# Altium project UKU20710_POW.PrjPCB
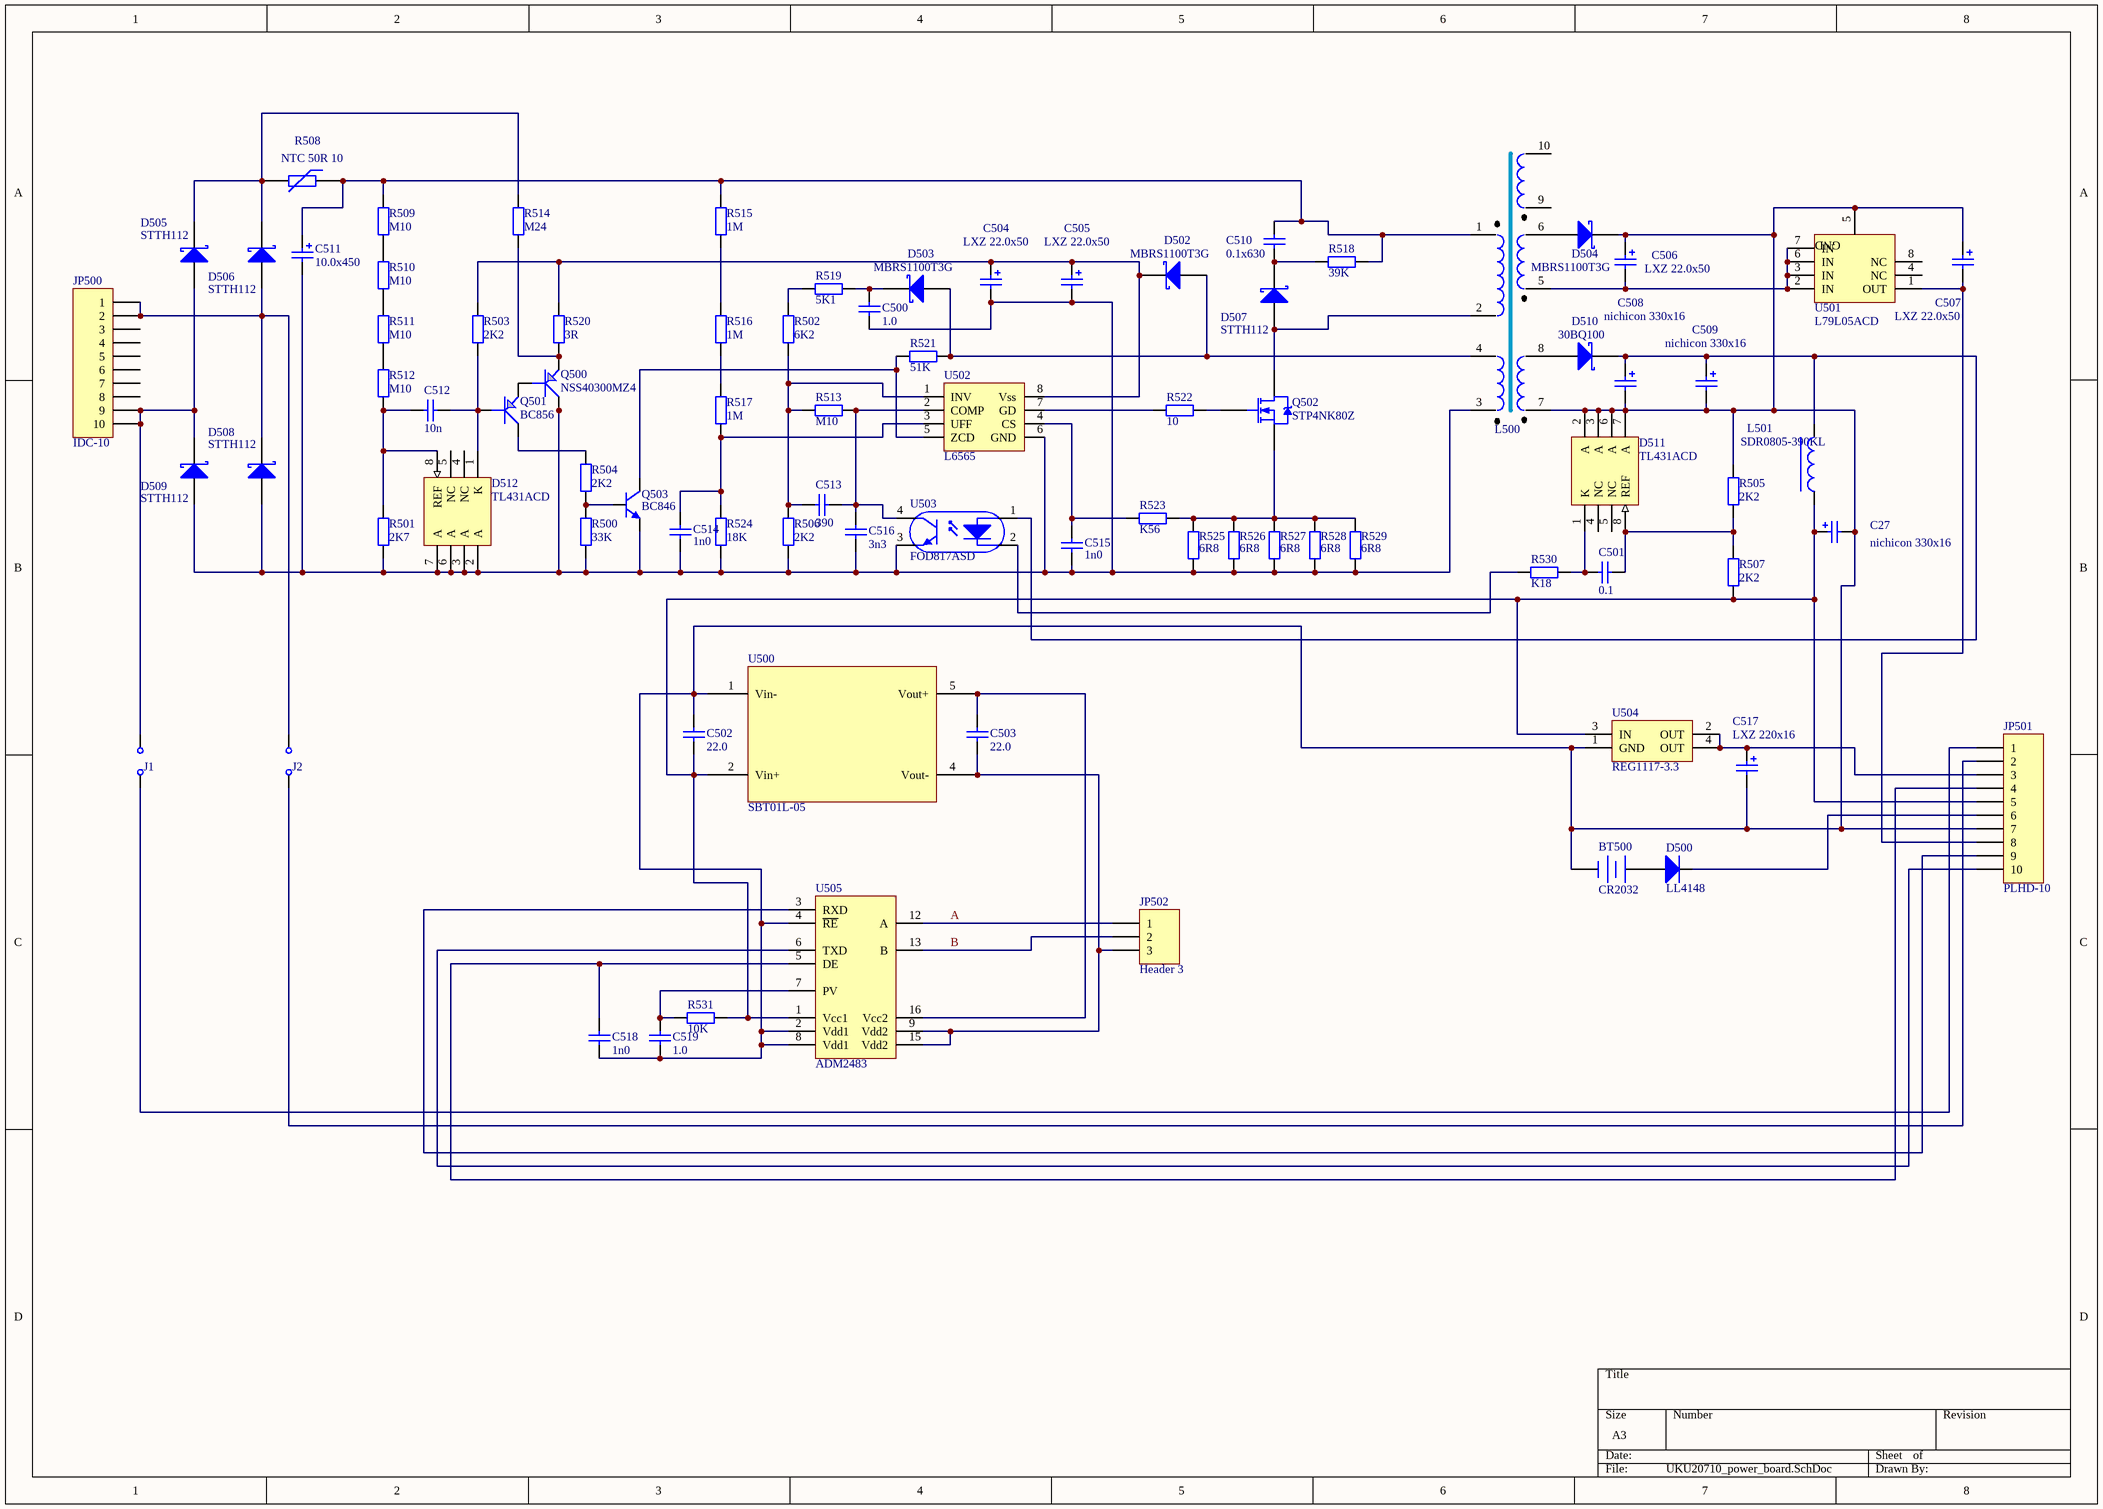
[diagram p0: UKU20710_power_board.SchDoc]
1 sheet, 83 parts. Net scope: global (net labels, ports and power ports of the same name join across sheets).
Board file: uku20710_pow.PcbDoc

## Sheet UKU20710_power_board.SchDoc
size A3

### Parts
BT500  CR2032  [BAT_SUPP]
C27  nichicon 330x16  [el3]
C500  1.0  [_1206]
C501  0.1  [_1206]
C502  22.0  [_1206]
C503  22.0  [_1206]
C504  LXZ 22.0x50  [el3]
C505  LXZ 22.0x50  [el3]
C506  LXZ 22.0x50  [el3]
C507  LXZ 22.0x50  [el3]
C508  nichicon 330x16  [el3]
C509  nichicon 330x16  [el3]
C510  0.1x630  [c15]
C511  10.0x450  [el_15_25_h]
C512  10n  [_1206]
C513  390  [_1206]
C514  1n0  [_1206]
C515  1n0  [_1206]
C516  3n3  [_1206]
C517  LXZ 220x16  [el3]
C518  1n0  [_1206]
C519  1.0  [_1206]
D500  LL4148  [_1206d]
D502  MBRS1100T3G  [D_6_3]
D503  MBRS1100T3G  [D_6_3]
D504  MBRS1100T3G  [D_6_3]
D505  STTH112  [D_6_3]
D506  STTH112  [D_6_3]
D507  STTH112  [D_6_3]
D508  STTH112  [D_6_3]
D509  STTH112  [D_6_3]
D510  30BQ100  [30BQ100]
D511  TL431ACD  [SO-G8]
D512  TL431ACD  [SO-G8]
J1  (no value)  [BT5-2]
J2  (no value)  [BT5-2]
JP500  IDC-10  [HDR2X5]
JP501  PLHD-10  [HDR2X5]
JP502  Header 3  [2EDG-5.08-3P]
L500  L220-K10  [trans_ring1]  (value not drawn)
L501  SDR0805-390KL  [L10x10]
Q500  NSS40300MZ4  [DSO-G3]
Q501  BC856  [SO-G3]
Q502  STP4NK80Z  [TO220_h]
Q503  BC846  [SO-G3]
R500  33K  [_1206]
R501  2K7  [_1206]
R502  6K2  [_1206]
R503  2K2  [_1206]
R504  2K2  [_1206]
R505  2K2  [_1206]
R506  2K2  [_1206]
R507  2K2  [_1206]
R508  NTC 50R 10  [JVR07N]
R509  M10  [_1206]
R510  M10  [_1206]
R511  M10  [_1206]
R512  M10  [_1206]
R513  M10  [_1206]
R514  M24  [AXIAL-0.7]
R515  1M  [_1206]
R516  1M  [_1206]
R517  1M  [_1206]
R518  39K  [AXIAL-0.7]
R519  5K1  [_1206]
R520  3R  [_1206]
R521  51K  [_1206]
R522  10  [_1206]
R523  K56  [_1206]
R524  18K  [_1206]
R525  6R8  [_1206]
R526  6R8  [_1206]
R527  6R8  [_1206]
R528  6R8  [_1206]
R529  6R8  [_1206]
R530  K18  [_1206]
R531  10K  [_1206]
U500  SBT01L-05  [SBT01DET01]
U501  L79L05ACD  [SO-G8]
U502  L6565  [so-g8]
U503  FOD817ASD  [FOD817ASD]
U504  REG1117-3.3  [DSO-G3]
U505  ADM2483  [SO-G16/D10.4]

### Nets
A: JP502.1 U505.12(A)
B: JP502.2 U505.13(B)
NetBT500_1: BT500.1(+) D500.1(A)
NetBT500_2: BT500.2(-) C27.2 C502.1 C506.1 C507.1 C508.2 C509.2 C517.2 C518.1 C519.1 D504.2(K) D511.2(A) D511.3(A) D511.6(A) D511.7(A) JP501.7 L500.7 R505.2 U500.1(Vin-) U501.5(GND) U504.1(GND) U505.2(Vdd1) U505.4(~{RE}) U505.8(Vdd1)
NetC27_1: C27.1 C502.2 JP501.5 L501.1 R507.1 R531.1 U500.2(Vin+) U504.3(IN) U505.1(Vcc1)
NetC500_1: C500.1 C504.2 C505.2 C511.2 C514.2 C515.2 C516.1 D508.1(A) D509.1(A) D512.2(A) D512.3(A) D512.6(A) D512.7(A) L500.3 Q500.2(C) Q500.4(C) Q503.2(E) R500.1 R501.1 R506.1 R524.1 R525.2 R526.2 R527.2 R528.2 R529.2 U502.6(GND) U503.3
NetC500_2: C500.2 D503.2(K) R519.1
NetC501_1: C501.1 D511.8(REF) R505.1 R507.2
NetC501_2: C501.2 D511.1(K) R530.1
NetC503_1: C503.1 U500.5(Vout+) U505.16(Vcc2)
NetC503_2: C503.2 JP502.3 U500.4(Vout-) U505.9(Vdd2) U505.15(Vdd2)
NetC504_1: C504.1 C505.1 D502.2(K) R503.2 R520.2 U502.8(Vss)
NetC506_2: C506.2 L500.5 U501.2(IN) U501.3(IN) U501.6(IN) U501.7(IN)
NetC507_2: C507.2 JP501.8 U501.1(OUT)
NetC508_1: C508.1 C509.1 D510.2(K) L501.2 U503.1
NetC510_1: C510.1 D507.2(K) R518.2
NetC510_2: C510.2 C511.1 L500.1 R508.1 R509.2 R515.2 R518.1
NetC512_1: C512.1 D512.1(K) Q501.1(B) R503.1
NetC512_2: C512.2 D512.8(REF) R501.2 R512.1
NetC513_1: C513.1 R502.1 R506.2 R513.2 U502.1(INV)
NetC513_2: C513.2 C516.2 R513.1 U502.2(COMP) U503.4
NetC514_1: C514.1 R517.1 R524.2 U502.3(UFF)
NetC515_1: C515.1 R523.2 U502.4(CS)
NetC517_1: C517.1 JP501.3 U504.2(OUT) U504.4(OUT)
NetC518_2: C518.2 JP501.4 U505.5(DE)
NetC519_2: C519.2 R531.2 U505.7(PV)
NetD500_2: D500.2(K) JP501.6
NetD502_1: D502.1(A) D503.1(A) L500.4 R521.1
NetD504_1: D504.1(A) L500.6
NetD505_1: D505.1(A) D509.2(K) J1.2 JP500.9 JP500.10
NetD505_2: D505.2(K) D506.2(K) R508.2 R514.2
NetD506_1: D506.1(A) D508.2(K) J2.2 JP500.1 JP500.2
NetD507_1: D507.1(A) L500.2 Q502.2(D)
NetD510_1: D510.1(A) L500.8
NetJ1_1: J1.1 JP501.1
NetJ2_1: J2.1 JP501.2
NetJP501_9: JP501.9 U505.3(RXD)
NetJP501_10: JP501.10 U505.6(TXD)
NetQ500_1: Q500.1(B) Q501.2(E)
NetQ500_3: Q500.3(E) R514.1 R520.1
NetQ501_3: Q501.3(C) R504.2
NetQ502_1: Q502.1(G) R522.1
NetQ502_3: Q502.3(S) R523.1 R525.1 R526.1 R527.1 R528.1 R529.1
NetQ503_1: Q503.1(B) R500.2 R504.1
NetQ503_3: Q503.3(C) R521.2 U502.5(ZCD)
NetR502_2: R502.2 R519.2
NetR509_1: R509.1 R510.2
NetR510_1: R510.1 R511.2
NetR511_1: R511.1 R512.2
NetR515_1: R515.1 R516.2
NetR516_1: R516.1 R517.2
NetR522_2: R522.2 U502.7(GD)
NetR530_2: R530.2 U503.2

Not connected (* = marked no-connect by the designer): D511 4(NC) 5(NC); D512 4(NC) 5(NC); JP500 3 4 5 6 7 8; L500 9 10; U501 4(NC) 8(NC)

### Library data of the parts
BT500 = Battery: Multicell Battery; Manufacturer: Generic Components; Published: 24-Mar-1999; Revision: July-2002: Re-released for DXP Platform.; Publisher: Altium Limited
C27 C504-C509 C511 C517 = Cap Pol1: Polarized Capacitor (Radial); Manufacturer: Generic Components; Class I: Passive; Value: 22,0x50; Published: 8-Jun-2000; Revision: July-2002: Re-released for DXP Platform.; Publisher: Altium Limited; Class II: Capacitor
C500-C503 C510 C512-C516 C518 C519 = Cap Semi: Capacitor (Semiconductor SIM Model); Manufacturer: Generic Components; Class I: Passive; Value: 1,0; Published: 8-Jun-2000; Revision: July-2002: Re-released for DXP Platform.; Publisher: Altium Limited; Class II: Capacitor
D500 = Diode: Default Diode; Manufacturer: Generic Components; Class I: Discrete; Class II: Diode - Switching; Published: 8-Jun-2000; Revision: July-2002: Re-released for DXP Platform.; Publisher: Altium Limited
D502-D504 D510 = 10BQ015: Schottky Rectifier; Manufacturer: International Rectifier; Revision 1: 10-July-2000: SIM Model Added.; Revision 2: July-2002: Re-released for DXP Platform.; Class I: Discrete; Class II: Rectifier - Schottky; Published: 8-Jun-2000; Datasheet: Latest Revision: PD-2.396A; Package Reference: DO-214AA; Publisher: Altium Limited
D505-D509 = 10BQ015: Schottky Diode; Manufacturer: International Rectifier; Revision 1: 10-July-2000: SIM Model Added.; Revision 2: July-2002: Re-released for DXP Platform.; Class I: Discrete; Class II: Rectifier - Schottky; Value: 10BQ100; Published: 8-Jun-2000; Datasheet: Latest Revision: PD-2.396A; Package Reference: DO-214AA; Publisher: Altium Limited
D511 D512 = TL431ACD: Programmable Precision Reference; Manufacturer: Motorola; Class I: Power Management; Class II: Voltage Reference; Published: 15-Apr-2002; Datasheet: Linear and Interface Integrated Circuits, DL128 Rev2 (1988); Package Reference: 751-02; Publisher: Altium Limited
J1 J2 = JMP: Switch; Manufacturer: Generic Components; Published: 24-Mar-1999; Revision: July-2002: Re-released for DXP Platform.; Publisher: Altium Limited
JP500 JP501 = Header 10: Header, 10-Pin; Manufacturer: Generic Components; Class I: Connector; Revision: July-2002: Re-released for DXP Platform.; Publisher: Altium Limited
JP502 = Header 3: Header, 3-Pin; Manufacturer: Generic Components; Class I: Connector; Revision: July-2002: Re-released for DXP Platform.; Publisher: Altium Limited
L500 = L1_dc_2: Дроссель
L501 = Inductor Konstr 2: Magnetic-Core Inductor; Manufacturer: Generic Components; Class I: Passive; Published: 24-Mar-1999; Revision: July-2002: Re-released for DXP Platform.; Publisher: Altium Limited; Class II: Inductor
Q500 = NSS40300MZ4: Right: 20; Bottom: 20
Q501 = GT109: Bipolar transistor; Right: 20; Bottom: 20; Value: BC856
Q502 = NMOS-2: N-Channel Power MOSFET; Manufacturer: Generic Components; Class I: Discrete; Class II: MOSFET - Power; Note: Pin 2 is electrically connected to pin 4.; Published: 8-Jun-2000; Revision: July-2002: Re-released for DXP Platform.; Datasheet: Latest Revision: PD-9.814; Package Reference: TO-220AB; Publisher: Altium Limited
Q503 = BC847ALT1: General Purpose Transistor NPN Silicon; Manufacturer: Motorola; Package Information: Latest Revision: 1997; Class I: Discrete; Class II: BJT - Low Power; Published: 29-Sep-2000; Revision: July-2002: Re-released for DXP Platform.; Datasheet: Latest Revision: 1997; Package Reference: 318-08; Publisher: Altium Limited
R500-R507 R509-R531 = Res2: Resistor; Manufacturer: Generic Components; Class I: Passive; Value: 1K0; Rule: Undefined; Published: 8-Jun-2000; Revision: July-2002: Re-released for DXP Platform.; Publisher: Altium Limited; Class II: Resistor
R508 = Res Varistor: Varistor (Voltage-Sensitive Resistor); Manufacturer: Generic Components; Class I: Discrete; Published: 24-Mar-1999; Revision: July-2002: Re-released for DXP Platform.; Publisher: Altium Limited; Class II: Voltage-Sensitive Resistor
U500 = SBT01L
U501 = L79L05ACD: Negative Voltage Regulator; Manufacturer: ST-Microelectronics; Package Information: Latest Revision: Jul-1998; Class I: Power Management; Published: 24-Aug-2001; Revision: July-2002: Re-released for DXP Platform.; Datasheet: Latest Revision: Apr-1999; Package Reference: SO8; Publisher: Altium Limited; Class II: Voltage Regulator
U503 = F00817ASD
U504 = REG1117-3.3: 800mA and 1A Low Dropout Positive Regulator 2.85V, 3.3V, 5V, and Adjustable; Manufacturer: Burr-Brown; Package Information: Latest Revision: Rev. C; Class I: Power Management; Class II: Voltage Regulator; Published: 8-Jun-2000; Revision: July-2002: Re-released for DXP Platform.; Datasheet: Latest Revision: Sep-1997; Package Reference: ZZ311; Publisher: Altium Limited